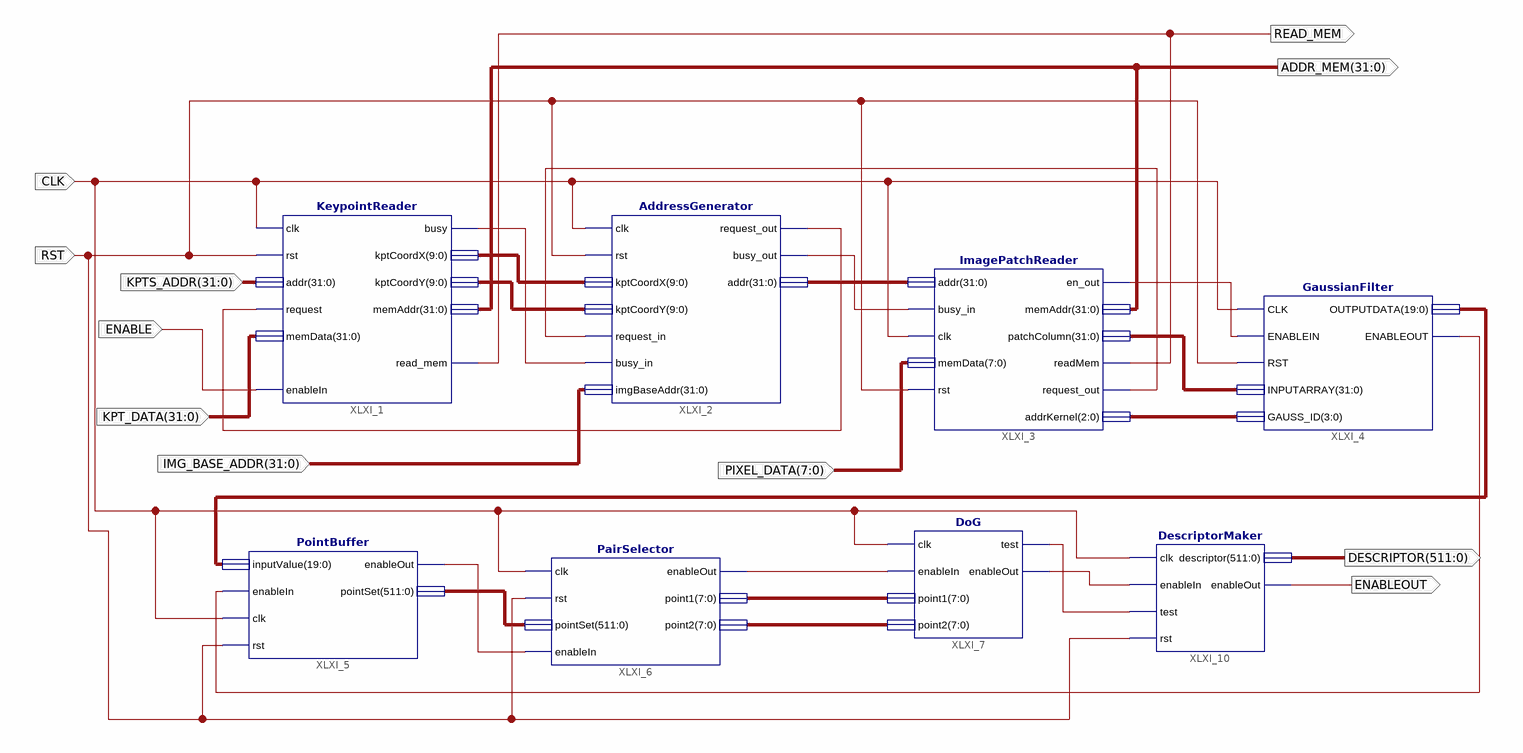
[diagram p0: schematic sheet 1]
// Xilinx ISE schematic RetinaDescriptorGenerator.sch (virtex5) as structural Verilog: 8 symbols, 11 ports
module RetinaDescriptorGenerator (
  input  [31:0] IMG_BASE_ADDR,
  input  RST,
  input  [31:0] KPTS_ADDR,
  input  ENABLE,
  input  CLK,
  input  [31:0] KPT_DATA,
  input  [7:0] PIXEL_DATA,
  output READ_MEM,
  output [31:0] ADDR_MEM,
  output [511:0] DESCRIPTOR,
  output ENABLEOUT
);

  wire XLXN_17, XLXN_43, XLXN_115, XLXN_119, XLXN_128, XLXN_135, XLXN_149, XLXN_161, XLXN_162, XLXN_167;
  wire [3:0] XLXN_134;
  wire [7:0] XLXN_18, XLXN_19;
  wire [9:0] XLXN_136, XLXN_137;
  wire [19:0] XLXN_42;
  wire [31:0] XLXN_168, XLXN_169;
  wire [511:0] XLXN_16;

  ImagePatchReader XLXI_3 (
    .addr(XLXN_168), .addrKernel(XLXN_134), .busy_in(XLXN_167), .clk(CLK), .en_out(XLXN_128),
    .memAddr(ADDR_MEM), .memData(PIXEL_DATA), .patchColumn(XLXN_169), .readMem(READ_MEM),
    .request_out(XLXN_115), .rst(RST));
  GaussianFilter XLXI_4 (
    .CLK(CLK), .ENABLEIN(XLXN_128), .ENABLEOUT(XLXN_43), .GAUSS_ID(XLXN_134), .INPUTARRAY(XLXN_169),
    .OUTPUTDATA(XLXN_42), .RST(RST));
  PairSelector XLXI_6 (
    .clk(CLK), .rst(RST), .pointSet(XLXN_16), .enableIn(XLXN_17), .enableOut(XLXN_119), .point1(XLXN_18),
    .point2(XLXN_19));
  PointBuffer XLXI_5 (
    .enableIn(XLXN_43), .inputValue(XLXN_42), .enableOut(XLXN_17), .pointSet(XLXN_16), .clk(CLK), .rst(RST));
  DoG XLXI_7 (
    .clk(CLK), .enableIn(XLXN_119), .point1(XLXN_18), .point2(XLXN_19), .test(XLXN_162), .enableOut(XLXN_161));
  DescriptorMaker XLXI_10 (
    .clk(CLK), .descriptor(DESCRIPTOR), .enableIn(XLXN_161), .enableOut(ENABLEOUT), .test(XLXN_162), .rst(RST));
  KeypointReader XLXI_1 (
    .addr(KPTS_ADDR), .clk(CLK), .memData(KPT_DATA), .request(XLXN_149), .rst(RST), .busy(XLXN_135),
    .kptCoordX(XLXN_136), .kptCoordY(XLXN_137), .memAddr(ADDR_MEM), .read_mem(READ_MEM), .enableIn(ENABLE));
  AddressGenerator XLXI_2 (
    .busy_in(XLXN_135), .clk(CLK), .kptCoordX(XLXN_136), .kptCoordY(XLXN_137), .request_in(XLXN_115),
    .rst(RST), .addr(XLXN_168), .busy_out(XLXN_167), .request_out(XLXN_149), .imgBaseAddr(IMG_BASE_ADDR));
endmodule
